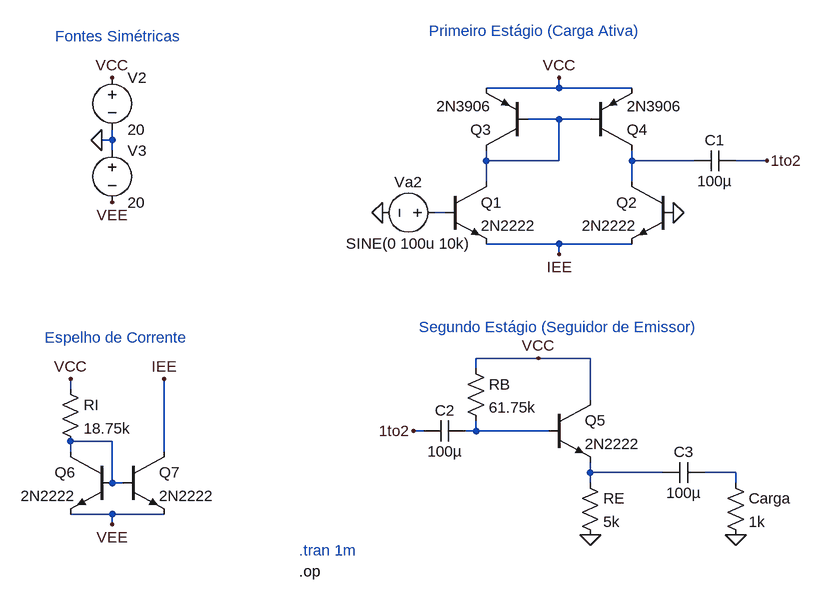
[diagram p0: schematic trabalho1.asc]
trabalho1.asc, the LTspice schematic file:
Version 4
SHEET 1 2380 680
WIRE 736 -352 736 -368
WIRE 736 -352 624 -352
WIRE 848 -352 736 -352
WIRE 736 -304 688 -304
WIRE 784 -304 736 -304
WIRE 48 -272 48 -288
WIRE 48 -272 32 -272
WIRE 48 -256 48 -272
WIRE 624 -240 624 -256
WIRE 736 -240 736 -304
WIRE 736 -240 624 -240
WIRE 848 -240 848 -256
WIRE 944 -240 848 -240
WIRE 1056 -240 1008 -240
WIRE 624 -208 624 -240
WIRE 848 -208 848 -240
WIRE 560 -160 544 -160
WIRE 736 -112 624 -112
WIRE 848 -112 736 -112
WIRE 736 -96 736 -112
WIRE 704 64 608 64
WIRE 784 64 704 64
WIRE 608 80 608 64
WIRE -16 112 -16 96
WIRE 784 128 784 64
WIRE 528 176 512 176
WIRE 608 176 608 160
WIRE 608 176 592 176
WIRE 720 176 608 176
WIRE 48 192 -16 192
WIRE -16 208 -16 192
WIRE 128 208 128 96
WIRE 784 240 784 224
WIRE 896 240 784 240
WIRE 1008 240 960 240
WIRE 48 256 48 192
WIRE 64 256 48 256
WIRE 784 256 784 240
WIRE 1008 256 1008 240
WIRE 48 304 -16 304
WIRE 128 304 48 304
WIRE 48 320 48 304
FLAG -16 96 VCC
FLAG 48 320 VEE
FLAG 128 96 IEE
FLAG 464 -160 0
FLAG 912 -160 0
FLAG 736 -368 VCC
FLAG 48 -368 VCC
FLAG 48 -176 VEE
FLAG 32 -272 0
FLAG 736 -96 IEE
FLAG 704 64 VCC
FLAG 784 336 0
FLAG 1008 336 0
FLAG 1056 -240 1to2
FLAG 512 176 1to2
SYMBOL res -32 96 R0
SYMATTR InstName RI
SYMATTR Value 18.75k
SYMBOL npn 48 208 M0
SYMATTR InstName Q6
SYMATTR Value 2N2222
SYMBOL npn 64 208 R0
SYMATTR InstName Q7
SYMATTR Value 2N2222
SYMBOL npn 560 -208 R0
SYMATTR InstName Q1
SYMATTR Value 2N2222
SYMBOL npn 912 -208 M0
SYMATTR InstName Q2
SYMATTR Value 2N2222
SYMBOL pnp 688 -256 R180
SYMATTR InstName Q3
SYMATTR Value 2N3906
SYMBOL pnp 784 -256 M180
SYMATTR InstName Q4
SYMATTR Value 2N3906
SYMBOL voltage 48 -384 R0
WINDOW 123 0 0 Left 0
WINDOW 39 0 0 Left 0
SYMATTR InstName V2
SYMATTR Value 20
SYMBOL voltage 48 -272 R0
WINDOW 123 0 0 Left 0
WINDOW 39 0 0 Left 0
SYMATTR InstName V3
SYMATTR Value 20
SYMBOL cap 1008 -256 R90
WINDOW 0 0 32 VBottom 2
WINDOW 3 32 32 VTop 2
SYMATTR InstName C1
SYMATTR Value 100µ
SYMBOL res 592 64 R0
SYMATTR InstName RB
SYMATTR Value 61.75k
SYMBOL npn 720 128 R0
SYMATTR InstName Q5
SYMATTR Value 2N2222
SYMBOL res 768 240 R0
SYMATTR InstName RE
SYMATTR Value 5k
SYMBOL res 992 240 R0
SYMATTR InstName Carga
SYMATTR Value 1k
SYMBOL voltage 560 -160 R90
WINDOW 0 -32 56 VBottom 2
WINDOW 3 32 56 VTop 2
WINDOW 123 0 0 Left 0
WINDOW 39 0 0 Left 0
SYMATTR InstName Va2
SYMATTR Value SINE(0 100u 10k)
SYMBOL cap 592 160 R90
WINDOW 0 0 32 VBottom 2
WINDOW 3 32 32 VTop 2
SYMATTR InstName C2
SYMATTR Value 100µ
SYMBOL cap 960 224 R90
WINDOW 0 0 32 VBottom 2
WINDOW 3 32 32 VTop 2
SYMATTR InstName C3
SYMATTR Value 100µ
TEXT -40 -432 Left 2 ;Fontes Simétricas
TEXT -56 32 Left 2 ;Espelho de Corrente
TEXT 536 -440 Left 2 ;Primeiro Estágio (Carga Ativa)
TEXT 520 16 Left 2 ;Segundo Estágio (Seguidor de Emissor)
TEXT 336 360 Left 2 ;.tran 1m
TEXT 336 392 Left 2 !.op

The netlist it stands for:
* trabalho1.asc
RI VCC N005 18.75k
Q6 N005 N005 VEE 0 2N2222
Q7 IEE N005 VEE 0 2N2222
Q1 N001 N003 IEE 0 2N2222
Q2 N002 0 IEE 0 2N2222
Q3 N001 N001 VCC 0 2N3906
Q4 N002 N001 VCC 0 2N3906
V2 VCC 0 20
V3 0 VEE 20
C1 1to2 N002 100µ
RB VCC N004 61.75k
Q5 VCC N004 N006 0 2N2222
RE N006 0 5k
R§Carga N007 0 1k
Va2 N003 0 SINE(0 100u 10k)
C2 N004 1to2 100µ
C3 N007 N006 100µ
.model NPN NPN
.model PNP PNP
.lib standard.bjt
* Fontes Simétricas
* Espelho de Corrente
* Primeiro Estágio (Carga Ativa)
* Segundo Estágio (Seguidor de Emissor)
* .tran 1m
.op
.backanno
.end